# Altium project HYDRA_V2.1_POWER.PrjPcb
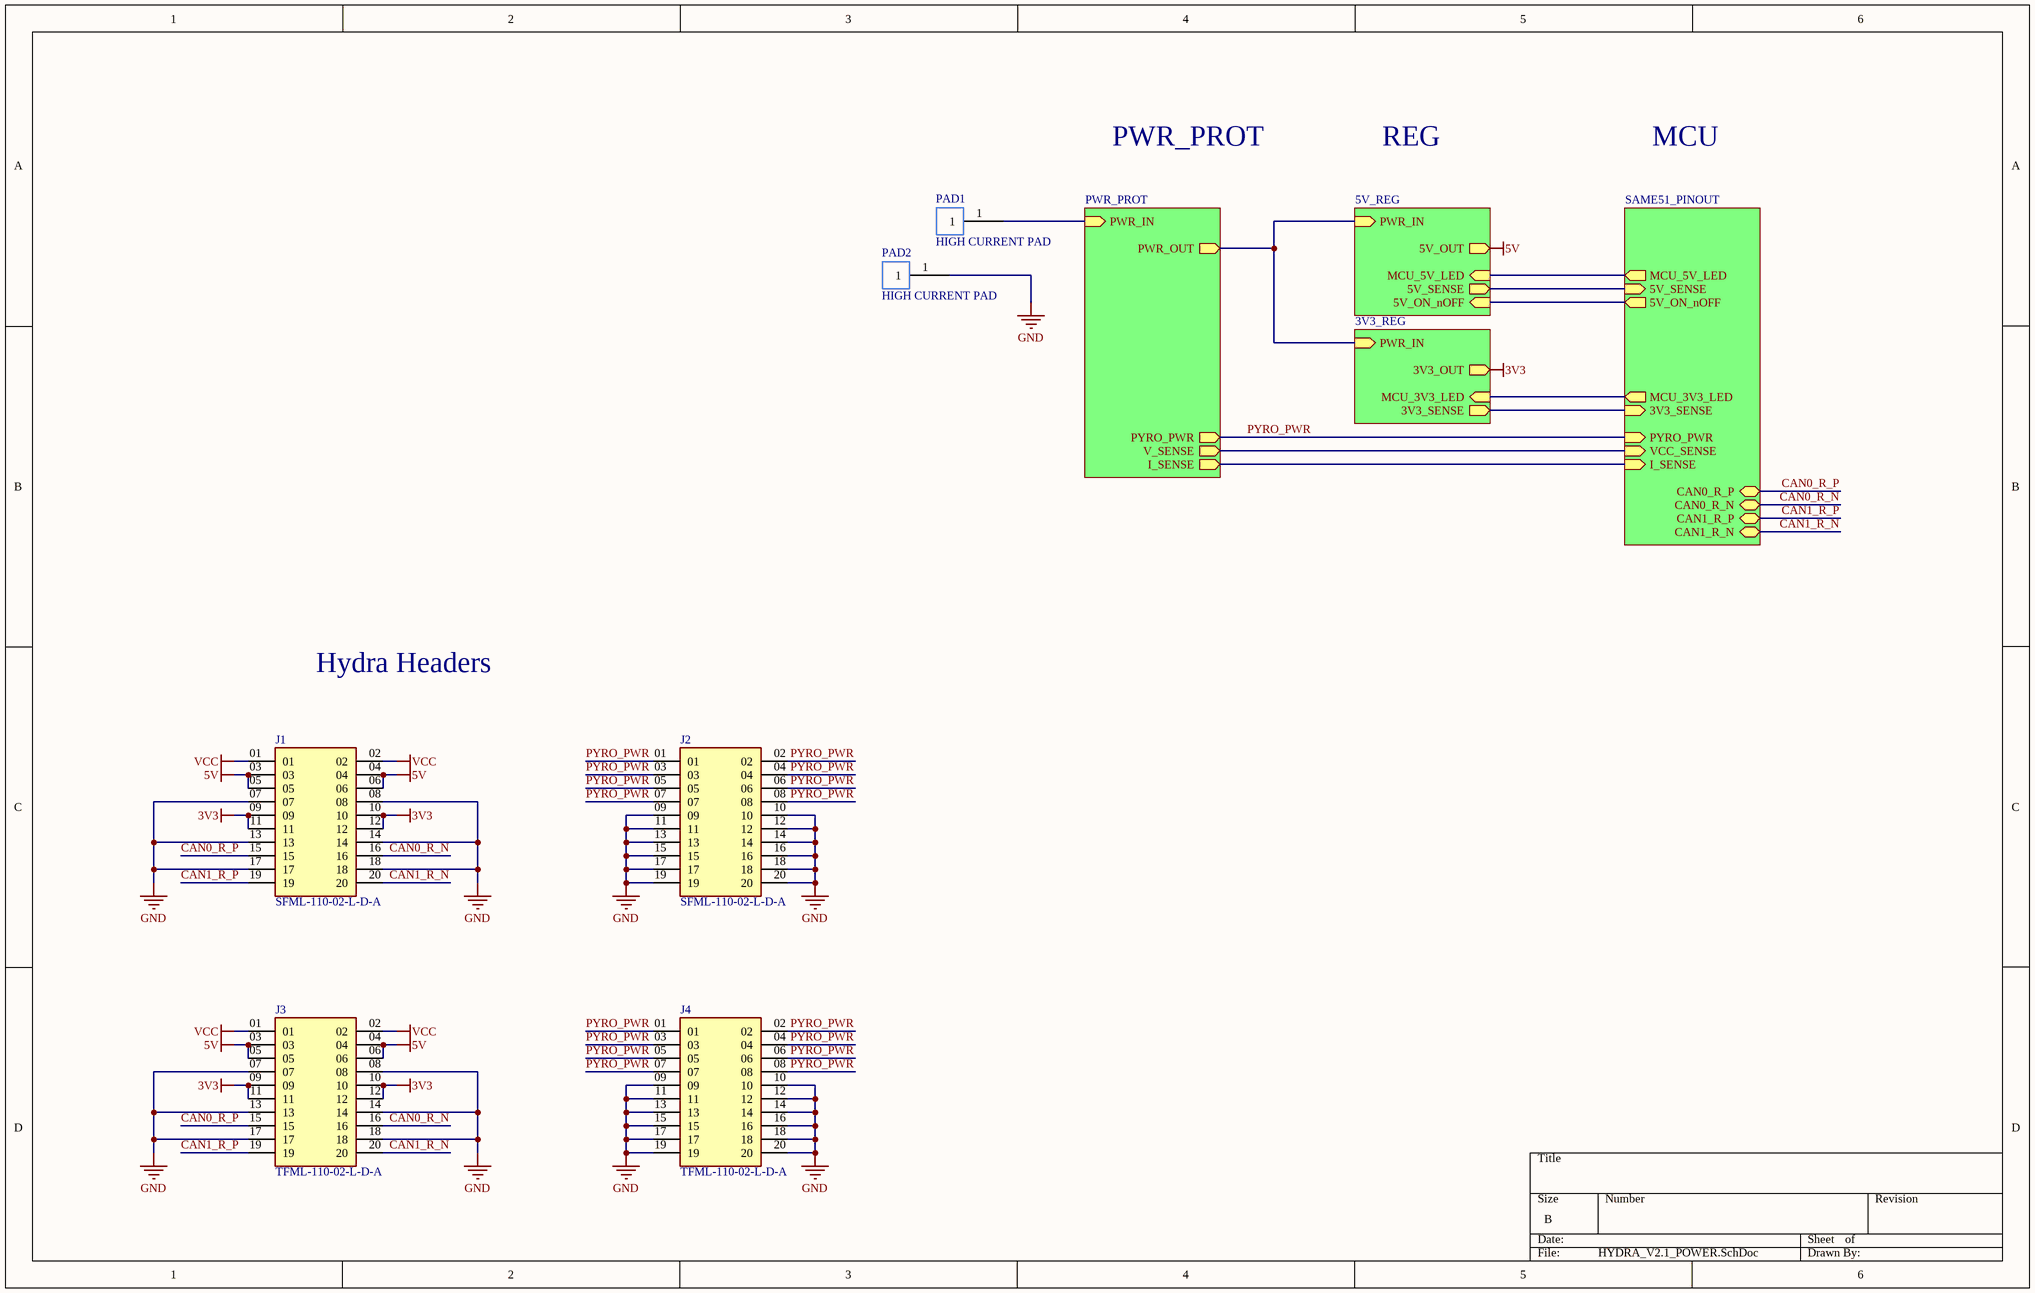
[diagram p0: HYDRA_V2.1_POWER.SchDoc]
5 sheets, 102 parts. Net scope: hierarchical (ports join the sheet entries above them; power ports are global).
Board file: HYDRA_V2.1_POWER.PcbDoc
Sheets:
  HYDRA_V2.1_POWER.SchDoc
    MCU_PINOUT = SAME51_PINOUT.SchDoc
    5V_REG = 5V_REG.SchDoc
    3V3_REG = 3V3_REG.SchDoc
    PWR_PROT = PWR_PROT.SchDoc

## Sheet HYDRA_V2.1_POWER.SchDoc
size B; SheetNumber: 1; SheetTotal: 6

### Parts
J1  SFML-110-02-L-D-A  [SFML-110-02-L-D-A-Footprint-1]
J2  SFML-110-02-L-D-A  [SFML-110-02-L-D-A-Footprint-1]
J3  TFML-110-02-L-D-A  [TFML-110-02-L-D-A-Footprint-1]
J4  TFML-110-02-L-D-A  [TFML-110-02-L-D-A-Footprint-1]
PAD1  HIGH CURRENT PAD  [HIGH CURRENT PAD-Footprint-1]
PAD2  HIGH CURRENT PAD  [HIGH CURRENT PAD-Footprint-1]

### Sub-sheets
3V3_REG = 3V3_REG: PWR_IN (in), 3V3_OUT (out), MCU_3V3_LED (in), 3V3_SENSE (out)
5V_REG = 5V_REG: PWR_IN (in), 5V_OUT (out), MCU_5V_LED (in), 5V_SENSE (out), 5V_ON_nOFF (in)
MCU_PINOUT = SAME51_PINOUT: CAN0_R_P (bidir), CAN0_R_N (bidir), PYRO_PWR (in), CAN1_R_P (bidir), CAN1_R_N (bidir), VCC_SENSE (in), I_SENSE (in), 5V_SENSE (in), MCU_5V_LED (out), 3V3_SENSE (in), MCU_3V3_LED (out), 5V_ON_nOFF (out)
PWR_PROT = PWR_PROT: PWR_IN (in), PWR_OUT (out), V_SENSE (out), I_SENSE (out), PYRO_PWR (out)

### Nets
3V3: J1.09 J1.10 J1.11 J1.12 J3.09 J3.10 J3.11 J3.12 ; sheet 3V3_REG/3V3_OUT  [project net 3V3_FB]
5V: J1.03 J1.04 J1.05 J1.06 J3.03 J3.04 J3.05 J3.06 ; sheet 5V_REG/5V_OUT  [project net 5V_FB]
GND: J1.07 J1.08 J1.13 J1.14 J1.17 J1.18 J2.09 J2.10 J2.11 J2.12 J2.13 J2.14 J2.15 J2.16 J2.17 J2.18 J2.19 J2.20 J3.07 J3.08 J3.13 J3.14 J3.17 J3.18 J4.09 J4.10 J4.11 J4.12 J4.13 J4.14 J4.15 J4.16 J4.17 J4.18 J4.19 J4.20 PAD2.1
VCC: J1.01 J1.02 J3.01 J3.02
3V3_SENSE: sheet MCU_PINOUT/3V3_SENSE, sheet 3V3_REG/3V3_SENSE
5V_ON_nOFF: sheet MCU_PINOUT/5V_ON_nOFF, sheet 5V_REG/5V_ON_nOFF
5V_SENSE: sheet MCU_PINOUT/5V_SENSE, sheet 5V_REG/5V_SENSE
CAN0_R_N: J1.16 J3.16 ; sheet MCU_PINOUT/CAN0_R_N
CAN0_R_P: J1.15 J3.15 ; sheet MCU_PINOUT/CAN0_R_P
CAN1_R_N: J1.20 J3.20 ; sheet MCU_PINOUT/CAN1_R_N
CAN1_R_P: J1.19 J3.19 ; sheet MCU_PINOUT/CAN1_R_P
I_SENSE: sheet MCU_PINOUT/I_SENSE, sheet PWR_PROT/I_SENSE
MCU_3V3_LED: sheet MCU_PINOUT/MCU_3V3_LED, sheet 3V3_REG/MCU_3V3_LED
MCU_5V_LED: sheet MCU_PINOUT/MCU_5V_LED, sheet 5V_REG/MCU_5V_LED
POST_SHUNT: sheet 5V_REG/PWR_IN, sheet 3V3_REG/PWR_IN, sheet PWR_PROT/PWR_OUT
PYRO_PWR: J2.01 J2.02 J2.03 J2.04 J2.05 J2.06 J2.07 J2.08 J4.01 J4.02 J4.03 J4.04 J4.05 J4.06 J4.07 J4.08 ; sheet MCU_PINOUT/PYRO_PWR, sheet PWR_PROT/PYRO_PWR
V_SENSE: sheet MCU_PINOUT/VCC_SENSE, sheet PWR_PROT/V_SENSE
NetF2_1: PAD1.1 ; sheet PWR_PROT/PWR_IN

### Notes on the sheet
- PWR_PROT
- REG
- MCU
- Hydra Headers

### Library data of the parts
J1 J2 = CMP-002-00076-2: Headers & Wire Housings .050 Tiger Eye High-Reliability Locking Socket Strip
J3 J4 = CMP-002-00077-1: Conn Shrouded Header (4 Sides) HDR 20 POS 1.27mm Solder ST Top Entry SMD TIGER EYE™ Tube
PAD1 PAD2 = CMP-002-00087-2: Via stitched high current pad

## Sheet SAME51_PINOUT.SchDoc
size B; SheetNumber: 2; SheetTotal: 6
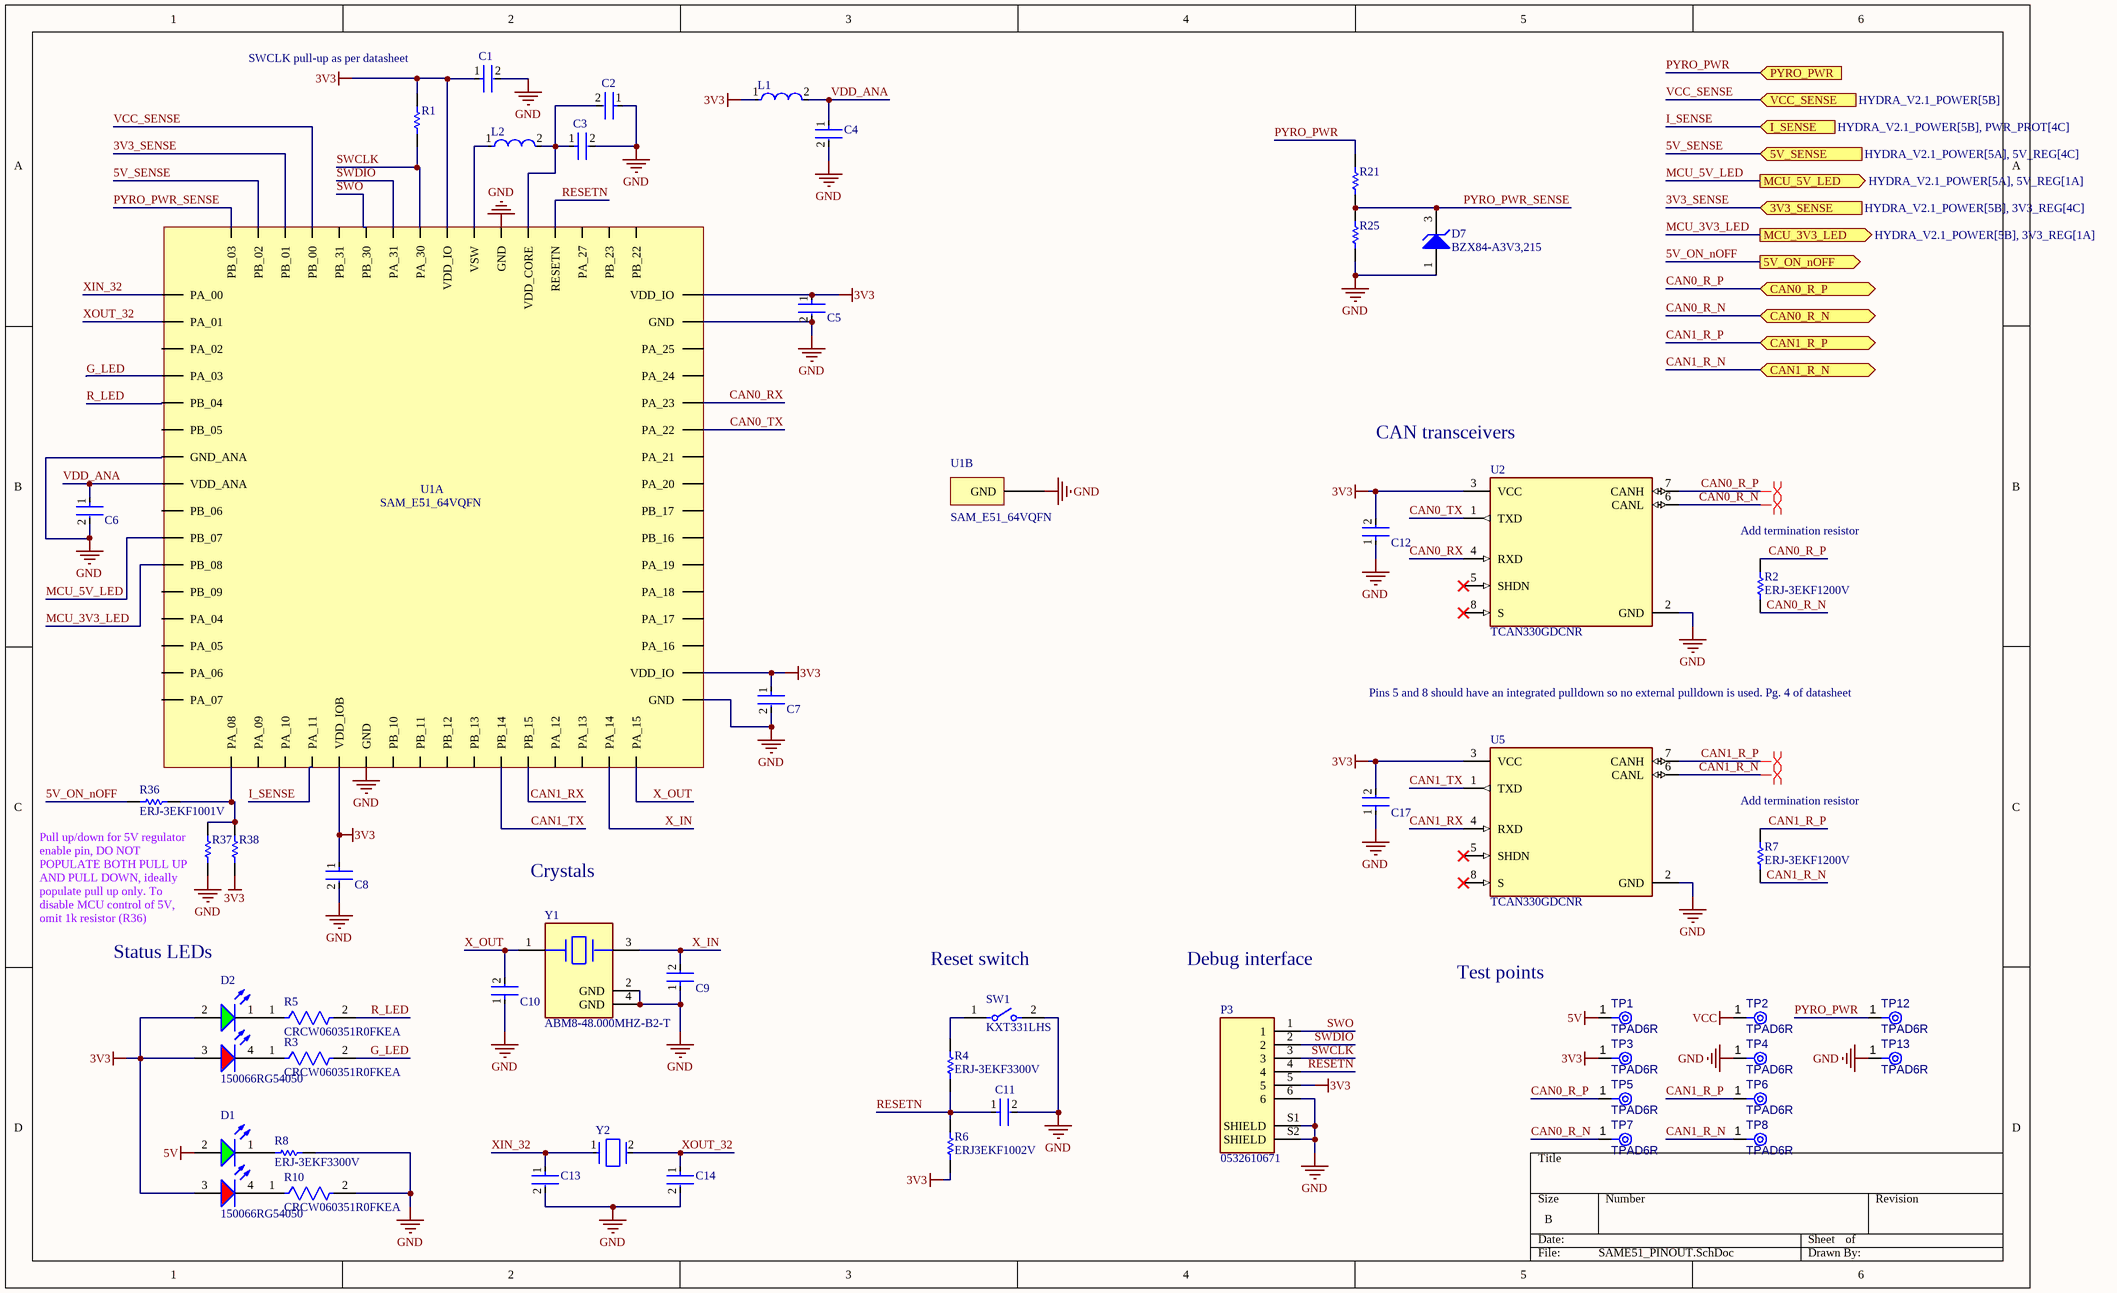
[diagram p1: SAME51_PINOUT.SchDoc]

### Parts
C1  C0402C104K8PACTU  [FP-C0402-BB-MFG]  (value not drawn)
C2  GRM155R60J475ME47D  [FP-GRM155-0_1-IPC_B]  (value not drawn)
C3  C0402C104K8PACTU  [FP-C0402-BB-MFG]  (value not drawn)
C4  C0805C106K8PACTU  [FP-C0805C-DG-MFG]  (value not drawn)
C5  C0402C104K8PACTU  [FP-C0402-BB-MFG]  (value not drawn)
C6  C0402C104K8PACTU  [FP-C0402-BB-MFG]  (value not drawn)
C7  C0402C104K8PACTU  [FP-C0402-BB-MFG]  (value not drawn)
C8  C0402C104K8PACTU  [FP-C0402-BB-MFG]  (value not drawn)
C9  08051A6R8CAT2A  [FP-0805-L_2_01_0_2-W_1_25-MFG]  (value not drawn)
C10  08051A6R8CAT2A  [FP-0805-L_2_01_0_2-W_1_25-MFG]  (value not drawn)
C11  C0402C104K8PACTU  [FP-C0402-BB-MFG]  (value not drawn)
C12  C0402C104K8PACTU  [FP-C0402-BB-MFG]  (value not drawn)
C13  C0805C180J5GACTU  [FP-C0805C-DN-MFG]  (value not drawn)
C14  C0805C180J5GACTU  [FP-C0805C-DN-MFG]  (value not drawn)
C17  C0402C104K8PACTU  [FP-C0402-BB-MFG]  (value not drawn)
D1  150066RG54050  [WL-SBCD_0606]
D2  150066RG54050  [WL-SBCD_0606]
D7  BZX84-A3V3,215  [SOT95P230X110-3N]
L1  NR6028T100M  [FP-NR6028-MFG]  (value not drawn)
L2  NR6028T100M  [FP-NR6028-MFG]  (value not drawn)
P3  0532610671  [0532610671-Footprint-1]
R1  ERJ3EKF1002V  [RESC1609X55X30LL15T15]  (value not drawn)
R2  ERJ-3EKF1200V  [RESC1609X55X30ML15T15]
R3  CRCW060351R0FKEA  [FP-CRCW0603-e3-MFG]
R4  ERJ-3EKF3300V  [RESC1608X55X30LL15T15]
R5  CRCW060351R0FKEA  [FP-CRCW0603-e3-MFG]
R6  ERJ3EKF1002V  [RESC1609X55X30LL15T15]
R7  ERJ-3EKF1200V  [RESC1609X55X30ML15T15]
R8  ERJ-3EKF3300V  [RESC1608X55X30LL15T15]
R10  CRCW060351R0FKEA  [FP-CRCW0603-e3-MFG]
R21  ERJ3EKF1002V  [RESC1609X55X30LL15T15]  (value not drawn)
R25  CRCW06032K70JNEA  [RESC1609X50X30ML10T20]  (value not drawn)
R36  ERJ-3EKF1001V  [RESC1608X55X30LL15T15]
R37  ERJ3EKF1002V  [RESC1609X55X30LL15T15]  (value not drawn)
R38  ERJ3EKF1002V  [RESC1609X55X30LL15T15]  (value not drawn)
SW1  KXT331LHS  [FP-KXT331LHS-MFG]
TP1  TPAD6R  [TP06R]  (no BOM)
TP2  TPAD6R  [TP06R]  (no BOM)
TP3  TPAD6R  [TP06R]  (no BOM)
TP4  TPAD6R  [TP06R]  (no BOM)
TP5  TPAD6R  [TP06R]  (no BOM)
TP6  TPAD6R  [TP06R]  (no BOM)
TP7  TPAD6R  [TP06R]  (no BOM)
TP8  TPAD6R  [TP06R]  (no BOM)
TP12  TPAD6R  [TP06R]  (no BOM)
TP13  TPAD6R  [TP06R]  (no BOM)
U1  SAM_E51_64VQFN  [SAM_E51_64VQFN-Footprint-1]  (parts A,B of 2)
U2  TCAN330GDCNR  [FP-DCN0008A-MFG]
U5  TCAN330GDCNR  [FP-DCN0008A-MFG]
Y1  ABM8-48.000MHZ-B2-T  [FP-ABM8-MFG]
Y2  ECS-.327-12.5-1210-TR  [FP-ECX-1210-MFG]  (value not drawn)

### Ports
3V3_SENSE (in, see HYDRA_V2.1_POWER[5B], 3V3_REG[4C]), 5V_ON_nOFF (out), 5V_SENSE (in, see HYDRA_V2.1_POWER[5A], 5V_REG[4C]), CAN0_R_N (bidir, see HYDRA_V2.1_POWER[6B]), CAN0_R_P (bidir, see HYDRA_V2.1_POWER[6B]), CAN1_R_N (bidir, see HYDRA_V2.1_POWER[6B]), CAN1_R_P (bidir, see HYDRA_V2.1_POWER[6B]), I_SENSE (in, see HYDRA_V2.1_POWER[5B], PWR_PROT[4C]), MCU_3V3_LED (out, see HYDRA_V2.1_POWER[5B], 3V3_REG[1A]), MCU_5V_LED (out, see HYDRA_V2.1_POWER[5A], 5V_REG[1A]), PYRO_PWR (in, see HYDRA_V2.1_POWER[5B], PWR_PROT[4B]), VCC_SENSE (in, see HYDRA_V2.1_POWER[5B])

### Nets
3V3: C1.1 C5.1 C7.1 C8.1 C12.2 C17.2 D1.3(A) D2.2(A) D2.3(A) L1.1 P3.5 R1.2 R6.1 R38.1 TP3.1(TP) U1.21(VDD_IOB) U1.34(VDD_IO) U1.48(VDD_IO) U1.56(VDD_IO) U2.3(VCC) U5.3(VCC)  [project net 3V3_FB]
5V: D1.2(A) TP1.1(TP)  [project net 5V_FB]
GND: C1.2 C2.1 C3.2 C4.2 C5.2 C6.2 C7.2 C8.2 C9.1 C10.1 C11.2 C12.1 C13.2 C14.2 C17.1 D7.1(A) P3.6 P3.S1(SHIELD) P3.S2(SHIELD) R8.2 R10.2 R25.1 R37.1 SW1.2 TP4.1(TP) TP13.1(TP) U1.7(GND_ANA) U1.22(GND) U1.33(GND) U1.47(GND) U1.54(GND) U1.65(GND) U2.2(GND) U5.2(GND) Y1.2(GND) Y1.4(GND)
VCC: TP2.1(TP)
3V3_SENSE: U1.62(PB_01) ; port 3V3_SENSE
5V_ON_nOFF: R36.1 ; port 5V_ON_nOFF
5V_SENSE: U1.63(PB_02) ; port 5V_SENSE
CAN0_R_N: R2.1 TP7.1(TP) U2.6(CANL) ; port CAN0_R_N
CAN0_R_P: R2.2 TP5.1(TP) U2.7(CANH) ; port CAN0_R_P
CAN0_RX: U1.44(PA_23) U2.4(RXD)
CAN0_TX: U1.43(PA_22) U2.1(TXD)
CAN1_R_N: R7.1 TP8.1(TP) U5.6(CANL) ; port CAN1_R_N
CAN1_R_P: R7.2 TP6.1(TP) U5.7(CANH) ; port CAN1_R_P
CAN1_RX: U1.28(PB_15) U5.4(RXD)
CAN1_TX: U1.27(PB_14) U5.1(TXD)
G_LED: R3.2 U1.4(PA_03)
I_SENSE: U1.20(PA_11) ; port I_SENSE
MCU_3V3_LED: U1.11(PB_08) ; port MCU_3V3_LED
MCU_5V_LED: U1.10(PB_07) ; port MCU_5V_LED
PYRO_PWR: R21.2 TP12.1(TP) ; port PYRO_PWR
PYRO_PWR_SENSE: D7.3(K) R21.1 R25.2 U1.64(PB_03)
R_LED: R5.2 U1.5(PB_04)
RESETN: C11.1 P3.4 R4.1 R6.2 U1.52(RESETN)
SWCLK: P3.3 R1.1 U1.57(PA_30)
SWDIO: P3.2 U1.58(PA_31)
SWO: P3.1 U1.59(PB_30)
VCC_SENSE: U1.61(PB_00) ; port VCC_SENSE  [project net V_SENSE]
VDD_ANA: C4.1 C6.1 L1.2 U1.8(VDD_ANA)
X_IN: C9.2 U1.31(PA_14) Y1.3
X_OUT: C10.2 U1.32(PA_15) Y1.1
XIN_32: C13.1 U1.1(PA_00) Y2.1(In/Out)
XOUT_32: C14.1 U1.2(PA_01) Y2.2(Out/In)
NetC2_2: C2.2 C3.1 L2.2 U1.53(VDD_CORE)
NetD1_1: D1.1(K) R8.1
NetD1_4: D1.4(K) R10.1
NetD2_1: D2.1(K) R5.1
NetD2_4: D2.4(K) R3.1
NetL2_1: L2.1 U1.55(VSW)
NetR4_2: R4.2 SW1.1
NetR36_2: R36.2 R37.2 R38.2 U1.17(PA_08)

Not connected (* = marked no-connect by the designer): U1 3(PA_02) 6(PB_05) 9(PB_06) 12(PB_09) 13(PA_04) 14(PA_05) 15(PA_06) 16(PA_07) 18(PA_09) 19(PA_10) 23(PB_10) 24(PB_11) 25(PB_12) 26(PB_13) 29(PA_12) 30(PA_13) 35(PA_16) 36(PA_17) 37(PA_18) 38(PA_19) 39(PB_16) 40(PB_17) 41(PA_20) 42(PA_21) 45(PA_24) 46(PA_25) 49(PB_22) 50(PB_23) 51(PA_27) 60(PB_31); U2 5(SHDN)* 8(S)*; U5 5(SHDN)* 8(S)*

### Layout directives
differential pair: CAN0_R_N, CAN0_R_P, CAN1_R_N, CAN1_R_P

### Notes on the sheet
- SWCLK pull-up as per datasheet
- (near U2) CAN transceivers
- (near R2) Add termination resistor
- Pins 5 and 8 should have an integrated pulldown so no external pulldown is used. Pg. 4 of datasheet
- (near R7) Add termination resistor
- Crystals
- Pull up/down for 5V regulator enable pin, DO NOT POPULATE BOTH PULL UP AND PULL DOWN, ideally populate pull up only. To disable MCU control of 5V, omit 1k resistor (R36)
- Status LEDs
- (near SW1) Reset switch
- Debug interface
- Test points

### Library data of the parts
C1 C3 C5-C8 C11 C12 C17 = CMP-2008-02046-2: CAP CER 0.1UF 10V X5R 0402; Manufacturer: Kemet; Material: Ceramic; Capacitance: 0.10 μF; Temperature Coefficient: 15%; Tolerance: 0.1; Value: 0.10 μF; Package: C0402-BB; Temperature: -55°C to +125°C; ComponentLink2Description: Datasheet; Temperature Characteristic: X5R; Device Class L1: Passive Components; Height: 0.55mm; Lead Free: Yes; ComponentLink2URL: https://content.kemet.com/datasheets/KEM_C1002_X7R_SMD.pdf; Device Class L2: Capacitors; Temperature Range Low: -55°C; Temperature Range High: +125°C; RoHS: TRUE; Octopart: https://octopart.com/c0402c104k8pactu-kemet-140039; Automotive: No; Mouser Description: Capacitor 100 nF 10 VDC 0402; Category: Cap; Voltage Rating: 10 V; Digikey Description: CAP CER 0.1UF 10V X5R 0402; Ipc Land Pattern Name: CAPC10050X50; Device Class L3: Ceramic Capacitors; Manufacturer Part Number: C0402C104K8PACTU
C2 = CMP-2008-04549-2: Chip Multilayer Ceramic Capacitors for General Purpose, 0402, 4.7uF, X5R, 15%, 20%, 6.3V; Height: 0.5mm; Weight: 0.000212oz; Length: 1mm; Case Code (Metric): 1005; Packaging: Tape and Reel; Termination: SMD/SMT; Dielectric: X5R; Depth: 0.5mm; Case Code (Imperial): 0402; Min Operating Temperature: -55°C; Case/Package: 0402; Voltage: 6.3V; Width: 0.02inch; Capacitance: 4.7uF; Lead Free: Lead Free; Thickness: 0.022inch; Contact Plating: Tin; REACH SVHC: No SVHC; Package Quantity: 10000; Tolerance: 20%; Voltage Rating (DC): 6.3V; Voltage Rating: 6.3V; Mount: Surface Mount; Max Operating Temperature: 85°C
C4 = CMP-2007-03243-2: CAP CER 10UF 10V X5R 0805; Manufacturer: Kemet; 3DS Part Number: 220-00001; Tolerance: 10%; Temperature Coefficient: 15%; Material: Ceramic; Device Class L2: Capacitors; Device Class L1: Passive Components; ComponentLink2URL: https://content.kemet.com/datasheets/KEM_C1006_X5R_SMD.pdf; Height: 1.4mm; Lead Free: Yes; Manufacturer Part Number: C0805C106K8PACTU; Digikey Description: CAP CER 10UF 10V X5R 0805; Octopart: https://octopart.com/c0805c106k8pactu-kemet-98697; Capacitance: 10uF; Value: 10uF; Temperature Range Low: -55°C; Temperature: -55°C to +85°C; Automotive: No; Mouser Description: CAP CER 10UF 10V X5R 0805; Ipc Land Pattern Name: CAPC200125X125; Temperature Range High: +85°C; Voltage: 10V; RoHS: TRUE; Device Class L3: Ceramic Capacitors; ComponentLink2Description: Datasheet; Voltage Rating: 10V; Package: C0805C-DG; Temperature Characteristic: X5R; Category: Cap
C9 C10 = CMP-1036-00709-3: General Purpose Ceramic Capacitor, 0805, 6.8pF, 0.25pF, C0G, 30ppm/°C, 100V; Dissipation Factor: 10%; Insulation Resistance: 100GR; Tolerance: 5%; Max Operating Temperature: 125°C; RoHS Compliant: Yes; Capacitance: 6.8pF; Termination: SMD/SMT; Number of Pins: 2; Packaging: Tape and Reel; Mount: Surface Mount; Case Code (Metric): 2012; Case Code (Imperial): 0805; Height: 0.71mm; Min Operating Temperature: -55°C; Width: 0.049inch; Temperature Coefficient: 0ppm/°C; Length: 2.01mm; Dielectric: C0G; Series: -; Voltage Rating (DC): 100V; Dielectric Material: Ceramic; Depth: 1.25mm; Contact Plating: Tin; Voltage Rating: 100V; Thickness: 0.037inch; Case/Package: 0805; Lead Free: Lead Free; Radiation Hardening: No; Voltage: 100V; Construction: Flat; Package Quantity: 1; REACH SVHC: No SVHC
C13 C14 = CMP-2007-00302-2: CAP CER 18PF 50V C0G/NP0 0805; Manufacturer: KEMET; Temperature Characteristic: C0G; Tolerance: 0.05; Material: Ceramic; Temperature Coefficient: 30ppm/°C; Device Class L2: Capacitors; Capacitance: 18 pF; Temperature: -55°C to +125°C; Value: 18 pF; Package: C0805C-DN; Mouser Description: Cap Ceramic 18pF 50V C0G 5% SMD 0805 125C Paper T/R; Height: 0.88mm; ComponentLink2URL: https://content.kemet.com/datasheets/KEM_C1003_C0G_SMD.pdf; RoHS: TRUE; Octopart: https://octopart.com/c0805c180j5gactu-kemet-144810; ComponentLink2Description: Datasheet; Temperature Range High: +125°C; Digikey Description: CAP CER 18PF 50V C0G/NP0 0805; Device Class L1: Passive Components; Category: Cap; Automotive: No; Device Class L3: Ceramic Capacitors; Voltage Rating: 50 V; Temperature Range Low: -55°C; Ipc Land Pattern Name: CAPC200125X78; Lead Free: Yes; Manufacturer Part Number: C0805C180J5GACTU
D1 D2 = CMP-004-00034-2: Led, Red/Grn, 180Mcd/230Mcd, 624Nm/525Nm Rohs Compliant: Yes
D7 = CMP-004-00035-1: DIODE ZENER 3.3V 250MW SOT23
L1 L2 = CMP-14484-000406-1: SMD Power Inductors 10uH ±20% 1.9A 84.5mΩ; Core Material: Ferrite; Self Resonant Frequency: 20MHz; Test Frequency: 100kHz; DC Resistance (DCR): 84.5mR; Shielding: Shielded; Current Rating: 1.9A; Package Quantity: 2000; Tolerance: 20%; Saturation Current: 1.9A; Max Operating Temperature: 120°C; Case/Package: 2424; Number of Pins: 2; Lead Free: Lead Free; Series: NR; Inductance Tolerance: 20%; RMS Current (Irms): 1.9A; Max DC Current: 1.9A; Resistor Type: Wirewound; Min Operating Temperature: -25°C; Width: 6mm; Height - Seated (Max): 0.11inch; RoHS Compliant: Yes; Mount: Surface Mount; Packaging: Tape and Reel; Inductance: 10uH; Length: 0.236inch; Halogen Free: Halogen Free; Height: 2.8mm; Termination: SMD/SMT
P3 = CMP-002-00079-1: Conn Shrouded Header (4 Sides) HDR 6 POS 1.25mm Solder RA Side Entry SMD PicoBlade™ T/R
R1 R6 R21 R37 R38 = CMP-1012-00623-3: Chip Resistor, 10 KOhm, +/- 1%, 0.1 W, -55 to 155 degC, 0603 (1608 Metric), RoHS, Tape and Reel; Manufacturer: Panasonic; Voltage Rating: 75V; Case\/Package: 0603; Power Rating: 100mW; Resistance: 10KOhm; Temperature Coefficient: 100ppm\/degreesC; Number of Pins: 2; Package Reference: 603; Depth: 0.8mm; Mount: SurfaceMount; Package Description: 2-Pin Surface Mount Device, Body 1.6 x 0.85 mm; Datasheet Version: 02/2017; Length: 1.6mm; Lead Free: LeadFree; Height: 0.45mm; Number of Terminations: 2; Max Power Dissipation: 100mW; Min Operating Temperature: -55degC; Datasheet URL: https://industrial.panasonic.com/cdbs/www-data/pdf/RDA0000/AOA0000C304.pdf; Termination: SMD/SMT; Case Code (Metric): 1608; Case Code (Imperial): 0603; Tolerance: 1%; Max Operating Temperature: 155degC; RoHSCompliant: true; Voltage Rating (DC): 75V; Radiation Hardening: No; Packaging: TapeandReel; Composition: ThickFilm; Mounting Technology: SurfaceMount; Manufacturer URL: http://www.panasonic.com/; Width: 0.031inch; REACH SVHC: NoSVHC; Contact Plating: Tin; Military Standard: Not; Package Quantity: 1
R2 R7 = CMP-2000-00213-2: Chip Resistor, 120 Ohm, +/- 1%, 0.1 W, -55 to 155 degC, 0603 (1608 Metric), RoHS, Tape and Reel; Manufacturer: Panasonic; Power Rating: 100mW; Voltage Rating (DC): 75V; Resistance: 120Ohm; Temperature Coefficient: 100ppm/degreesC; Number of Terminations: 2; Military Standard: Not; Tolerance: 1%; Min Operating Temperature: -55degC; Packaging: TapeandReel; Lead Free: LeadFree; Max Operating Temperature: 155degC; Manufacturer URL: http://www.panasonic.com/; Case Code (Imperial): 0603; REACH SVHC: NoSVHC; Width: 0.031inch; Datasheet URL: https://industrial.panasonic.com/cdbs/www-data/pdf/RDA0000/AOA0000C283.pdf; RoHSCompliant: true; Max Power Dissipation: 100mW; Termination: SMD/SMT; Package Reference: 0603; Height: 0.022inch; Depth: 0.8mm; Package Description: 2-Pin Surface Mount Device, Body 1.6 x 0.85 mm; Contact Plating: Tin; Length: 1.6mm; Package URL: http://www.st.com/st-web-ui/static/active/en/resource/technical/document/datasheet/CD00001320.pdf; Radiation Hardening: No; Package Quantity: 1; Number of Pins: 2; Datasheet Version: 42095.0; Voltage Rating: 75V; Composition: ThickFilm; Case/Package: 0603; Mount: SurfaceMount; Case Code (Metric): 1608
R3 R5 R10 = CMP-2000-03446-2: RES Thick Film, 51Ω, 1%, 0.1W, 100ppm/°C, 0603; Power Rating: 100mW; Voltage Rating: 75V; Resistance: 51R; Military Standard: Not; Case Code (Imperial): 0603; Max Operating Temperature: 155°C; Temperature Coefficient: 100ppm/°C; Lead Free: Lead Free; Weight: 7.1E-05oz; Number of Pins: 2; Package Quantity: 10; Case/Package: 0603; Termination: SMD/SMT; Min Operating Temperature: -55°C; Tolerance: 1%; Contact Plating: Tin; Height: 0.45mm; Working Voltage: 75V; Radiation Hardening: No; Packaging: Tape and Reel; Composition: Thick Film; Max Power Dissipation: 100mW; Width: 0.85mm; Depth: 0.85mm; Length: 1.55mm; Case Code (Metric): 1608; Voltage Rating (DC): 75V; Number of Terminations: 2; Features: Automotive AEC-Q200
R4 R8 = CMP-2000-00435-2: Chip Resistor, 330 Ohm, +/- 1%, 0.1 W, -55 to 155 degC, 0603 (1608 Metric), RoHS, Tape and Reel; Gender: Male; Mating Cycles: 10000; Current Rating: 500 mA; Voltage Rating: 10 V; REACH SVHC: No SVHC; PackageDescription: 2-Pin Surface Mount Device, Body 1.6 x 0.85 mm; Contact Finish: Gold; Pins: 8; ComponentLink1Description: Manufacturer URL; Packaging: Tape and Reel; Max Operating Temperature: 85 degC; Contact Material: Copper; Height: 1.45 mm; Width: 1.45 mm; DatasheetVersion: Apr-15; Package Quantity: 1500; Contact Plating: Gold; PackageReference: 0603; Mount: Surface Mount; Lead Pitch: 1.1 mm; Min Operating Temperature: -25 degC; ComponentLink1URL: http://www.panasonic.com/; ComponentLink2URL: http://industrial.panasonic.com/cdbs/www-data/pdf/RDA0000/AOA0000C86.pdf; Length: 13.7 mm; ComponentLink2Description: Datasheet; RoHSCompliant: true
R25 = CMP-2000-03183-1: Manufacturer: Vishay Dale; Part Number: CRCW06032K70JNEA
R36 = CMP-2000-00180-1: Manufacturer: Panasonic; Part Number: ERJ-3EKF1001V
SW1 = CMP-10040-000029-1: SWITCH TACTILE SPST-NO 0.02A 15V; Operating Force: 240gf; Switch Travel: 0.13mm; Illumination Type: Non-Illuminated; Throw Configuration: SPST; Number of Ports: 1; Current Rating: 5A; Mechanical Life: 500000Cycles; Switch Function: Off-Mom; Connector Type: USB; Actuator Type: Standard; Gender: Receptacle; Number of Contacts: 24; Contact Plating: Gold; Insulation Color: Black; Min Operating Temperature: -40°C; Packaging: Tape and Reel; Flammability Rating: UL94 V-0; Max Operating Temperature: 85°C; Termination: Solder; Mount: Surface Mount
TP1-TP8 TP12 TP13 = CMP-00028-00002-2: 0.6mm round; Pins: 1
U1 = CMP-016-00010-6: Rudimentary symbol and footprint for the SAM E51 microcontroller
U2 U5 = CMP-04872-000178-1: IC TRANSCEIVER 1/1 SOT23-8; Data Rate: 1Mbps; Packaging: Tape and Reel; Min Operating Temperature: -40°C; Max Operating Temperature: 125°C; RoHS Compliant: Yes; Lead Free: Lead Free; Case/Package: SOT-23-8; Mount: Surface Mount
Y1 = CMP-27762-011708-1: Crystal 48MHz ±20ppm 18pF SMD-4 3.2mm x 2.5mm; Series Resistance: 35R; Frequency Stability: 50ppm; Package Quantity: 1000; Packaging: Tape and Reel; Mount: Surface Mount; Length: 3.2mm; Load Capacitance: 18pF; Max Operating Temperature: 70°C; Operating Frequency: 48 MHz; RoHS Compliant: Yes; Series: ABM8; Frequency Tolerance: 20ppm; Lead Free: Lead Free; Min Operating Temperature: -20°C; Case/Package: CSMD; Number of Pins: 4; Height: 0.031inch; ESR (Equivalent Series Resistance): 35R; Frequency: 48MHz; Radiation Hardening: No; Width: 0.098inch; Tolerance: 20ppm; Termination: SMD/SMT; Depth: 2.5mm; Resistor Type: Ceramic; REACH SVHC: No SVHC
Y2 = CMP-40224-000006-1: CRYSTAL 32.7680KHZ 12.5PF SMD; Manufacturer: ECS International; Frequency: 32.768kHz; Esr: 90kΩ; Tolerance: 20ppm; Device Class L1: Passive Components; Load Capacitance: 12.5pF; Temperature: -40°C to +85°C; ComponentLink2URL: https://ecsxtal.com/store/pdf/ECX-1210.pdf; Series: ECX-1210; Octopart: https://octopart.com/ecs-.327-12.5-1210-tr-ecs+international-81221340; ComponentLink2Description: Datasheet; Temperature Range Low: -40°C; Digikey Description: CRYSTAL 32.7680KHZ 12.5PF SMD; Lead Free: Yes; RoHS: TRUE; Device Class L3: Crystals; Automotive: No; Category: Crys; Height: 0.5mm; Manufacturer Part Number: ECS-.327-12.5-1210-TR; Temperature Range High: +85°C; Device Class L2: Crystals / Oscillators; Package: ECX-1210

## Sheet 5V_REG.SchDoc
size A4; SheetNumber: 3; SheetTotal: 6
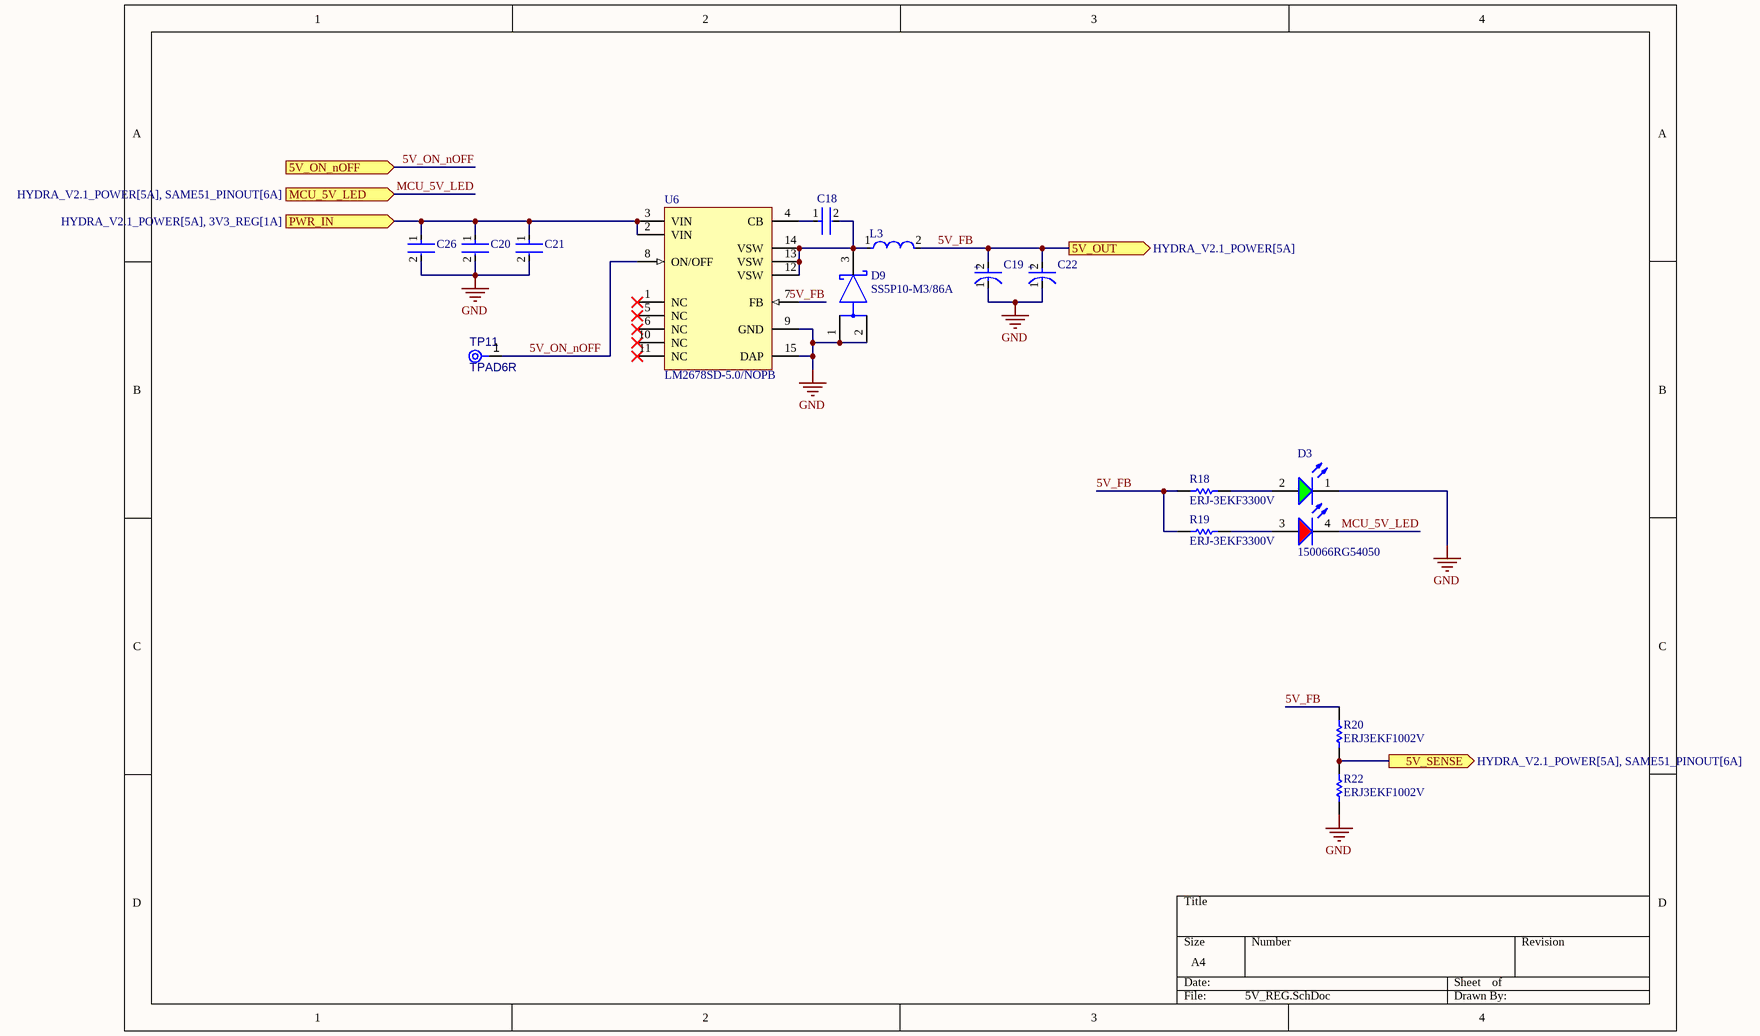
[diagram p2: 5V_REG.SchDoc]

### Parts
C18  C0805C103J5RACTU  [FP-C0805C-DN-MFG]  (value not drawn)
C19  10TPC68M  [FP-POSCAP-D2-MFG]  (value not drawn)
C20  C2012X5R1V156M125AC  [FP-C2012-125-0_2-MFG]  (value not drawn)
C21  C2012X5R1V156M125AC  [FP-C2012-125-0_2-MFG]  (value not drawn)
C22  10TPC68M  [FP-POSCAP-D2-MFG]  (value not drawn)
C26  C2012X5R1V156M125AC  [FP-C2012-125-0_2-MFG]  (value not drawn)
D3  150066RG54050  [WL-SBCD_0606]
D9  SS5P10-M3/86A  [FP-95570-MFG]
L3  IHLP4040DZER220M11  [FP-IHLP-4040DZ-FP_3_124x3-MFG]  (value not drawn)
R18  ERJ-3EKF3300V  [RESC1608X55X30LL15T15]
R19  ERJ-3EKF3300V  [RESC1608X55X30LL15T15]
R20  ERJ3EKF1002V  [RESC1609X55X30LL15T15]
R22  ERJ3EKF1002V  [RESC1609X55X30LL15T15]
TP11  TPAD6R  [TP06R]  (no BOM)
U6  LM2678SD-5.0/NOPB  [NHM0014A_V]

### Ports
5V_ON_nOFF (in), 5V_OUT (out, see HYDRA_V2.1_POWER[5A]), 5V_SENSE (out, see HYDRA_V2.1_POWER[5A], SAME51_PINOUT[6A]), MCU_5V_LED (in, see HYDRA_V2.1_POWER[5A], SAME51_PINOUT[6A]), PWR_IN (in, see HYDRA_V2.1_POWER[5A], 3V3_REG[1A])

### Nets
5V_FB: C19.2(A) C22.2(A) L3.2 R18.1 R19.1 R20.2 U6.7(FB) ; port 5V_OUT
GND: C19.1(C) C20.2 C21.2 C22.1(C) C26.2 D3.1(K) D9.1(A) D9.2(A) R22.1 U6.9(GND) U6.15(DAP)
5V_ON_nOFF: TP11.1(TP) U6.8(ON/OFF) ; port 5V_ON_nOFF
5V_SENSE: R20.1 R22.2 ; port 5V_SENSE
MCU_5V_LED: D3.4(K) ; port MCU_5V_LED
POST_SHUNT: C20.1 C21.1 C26.1 U6.2(VIN) U6.3(VIN) ; port PWR_IN
NetC18_1: C18.1 U6.4(CB)
NetC18_2: C18.2 D9.3(C) L3.1 U6.12(VSW) U6.13(VSW) U6.14(VSW)
NetD3_2: D3.2(A) R18.2
NetD3_3: D3.3(A) R19.2

Not connected (* = marked no-connect by the designer): U6 1(NC)* 5(NC)* 6(NC)* 10(NC)* 11(NC)*

### Notes on the sheet
- (in symbol CMP-05428-000598-1) +

### Library data of the parts
C18 = CMP-2007-00254-2: CAP CER 10000PF 50V X7R 0805; Manufacturer: KEMET; Value: 10,000 pF; Material: Ceramic; Temperature Coefficient: 30ppm/°C; Tolerance: 0.05; Device Class L1: Passive Components; Temperature: -55°C to +125°C; Lead Free: Yes; ComponentLink2URL: https://content.kemet.com/datasheets/KEM_C1003_C0G_SMD.pdf; Device Class L3: Ceramic Capacitors; Temperature Characteristic: X7R; Temperature Range High: +125°C; Mouser Description: Capacitor; Ceramic; Cap 0.01uF; Tol 5%; Vol-Rtg 50 V; SMT; Case 0805; X7R; TR; ComponentLink2Description: Datasheet; Manufacturer Part Number: C0805C103J5RACTU; Height: 0.88mm; Digikey Description: CAP CER 10000PF 50V X7R 0805; Capacitance: 10,000 pF; Temperature Range Low: -55°C; Device Class L2: Capacitors; Octopart: https://octopart.com/c0805c103j5ractu-kemet-133473; Voltage Rating: 50 V; Category: Cap; RoHS: TRUE; Automotive: No; Package: C0805C-DN; Ipc Land Pattern Name: CAPC200125X78
C19 C22 = CMP-05428-000598-1: Molded Tantalum Polymer Capacitor 68uF 20% 10V life 2000Hours SMD 2917; Dissipation Factor: 10%; ESR (Equivalent Series Resistance): 45mR; Leakage Current: 68uA; Polarity: Polar; Ripple Current: 1.7A; Material: Polymer; Voltage Rating: 10V; Voltage: 10V; Features: General Purpose; Width: 4.3mm; Packaging: Tape and Reel; Termination: SMD/SMT; Radiation Hardening: No; Construction: Flat; Height: 1.9mm; Height - Seated (Max): 0.079inch; Case Code (Metric): 7343; Length: 7.3mm; Case/Package: 2917; Depth: 4.3mm; Mount: Surface Mount; Capacitance: 68uF; Case Code (Imperial): 2917; Package Quantity: 3000; Tolerance: 20%; REACH SVHC: No SVHC; Series: POSCAP™ TPC; Lead Free: Lead Free; Min Operating Temperature: -55°C; RoHS Compliant: Yes; Voltage Rating (DC): 10V; Number of Pins: 2; Max Operating Temperature: 105°C
C20 C21 C26 = CMP-08246-005496-1: Multilayer Ceramic Capacitors 15μF ±20% 35V X5R SMD 0805; Capacitance: 15uF; Mount: Surface Mount; Dielectric Material: Ceramic; Package Quantity: 2000; Termination: SMD/SMT; Height: 1.25mm; Min Operating Temperature: -55°C; Tolerance: 20%; Width: 0.049inch; Length: 0.079inch; Lead Free: Lead Free; Max Operating Temperature: 85°C; Voltage Rating: 35V; Case/Package: 0805; Packaging: Tape and Reel; RoHS Compliant: Yes; Case Code (Metric): 2012; Voltage Rating (DC): 35V; Dielectric: X5R; Thickness: 0.057inch; Case Code (Imperial): 0805; Resistor Type: Ceramic; Series: C
D3 = CMP-004-00034-2: as D1 on sheet SAME51_PINOUT
D9 = CMP-02539-000057-1: DIODE SCHOTTKY 100V 5A TO277A; Max Forward Surge Current (Ifsm): 150A; Element Configuration: Common Cathode; Max Reverse Leakage Current: 15uA; Forward Voltage: 880mV; Case/Package: TO-277A; Number of Pins: 3; Max Reverse Voltage (DC): 100V; Height: 0.031inch; Peak Non-Repetitive Surge Current: 150A; Series: eSMP®; Radiation Hardening: No; Length: 0.242inch; Max Repetitive Reverse Voltage (Vrrm): 100V; Forward Current: 5A; Width: 0.171inch; Min Operating Temperature: -55°C; Max Surge Current: 150A; Lead Free: Lead Free; RoHS Compliant: Yes; Average Rectified Current: 5A; Max Operating Temperature: 150°C; Max Reverse Current: 15uA; Package Quantity: 1500; Packaging: Tape and Reel; Mount: Surface Mount
L3 = CMP-02424-000785-1: Commercial Inductors, Low DCR Series 22uH 5A 66mΩ 20%; Shielding: Shielded; Max DC Current: 4.5A; Test Frequency: 100kHz; DC Resistance (DCR): 66mR; Self Resonant Frequency: 1MHz; Core Material: Metal; Series: IHLP-4040DZ-11; Min Operating Temperature: -55°C; Rated Current-Max: 5A; Current Rating: 5A; Military Standard: Not; Depth: 10.3mm; Height - Seated (Max): 0.157inch; Contact Plating: Tin; Termination: SMD/SMT; Length: 0.43inch; Package Quantity: 1; Width: 0.405inch; Inductance Tolerance: 20%; Tolerance: 20%; Height: 4mm; RMS Current (Irms): 5A; Saturation Current: 4.5A; Inductance: 22uH; Mount: Surface Mount; Max Operating Temperature: 125°C; Case/Package: 4040; Packaging: Tape and Reel; Radiation Hardening: No; RoHS Compliant: Yes; Lead Free: Lead Free
R18 R19 = CMP-2000-00435-2: as R4 on sheet SAME51_PINOUT; REACH SVHC: No SVHC; PackageDescription: 2-Pin Surface Mount Device, Body 1.6 x 0.85 mm; Contact Finish: Gold; Pins: 8; ComponentLink1Description: Manufacturer URL; Packaging: Tape and Reel; Max Operating Temperature: 85 degC; Contact Material: Copper; Height: 1.45 mm; Width: 1.45 mm; DatasheetVersion: Apr-15; Package Quantity: 1500; Contact Plating: Gold; PackageReference: 0603; Mount: Surface Mount; Lead Pitch: 1.1 mm; Min Operating Temperature: -25 degC; ComponentLink1URL: http://www.panasonic.com/; ComponentLink2URL: http://industrial.panasonic.com/cdbs/www-data/pdf/RDA0000/AOA0000C86.pdf; Length: 13.7 mm; ComponentLink2Description: Datasheet; RoHSCompliant: true
R20 R22 = CMP-1012-00623-3: as R1 on sheet SAME51_PINOUT; Number of Pins: 2; Package Reference: 603; Depth: 0.8mm; Mount: SurfaceMount; Package Description: 2-Pin Surface Mount Device, Body 1.6 x 0.85 mm; Datasheet Version: 02/2017; Length: 1.6mm; Lead Free: LeadFree; Height: 0.45mm; Number of Terminations: 2; Max Power Dissipation: 100mW; Min Operating Temperature: -55degC; Datasheet URL: https://industrial.panasonic.com/cdbs/www-data/pdf/RDA0000/AOA0000C304.pdf; Termination: SMD/SMT; Case Code (Metric): 1608; Case Code (Imperial): 0603; Tolerance: 1%; Max Operating Temperature: 155degC; RoHSCompliant: true; Voltage Rating (DC): 75V; Radiation Hardening: No; Packaging: TapeandReel; Composition: ThickFilm; Mounting Technology: SurfaceMount; Manufacturer URL: http://www.panasonic.com/; Width: 0.031inch; REACH SVHC: NoSVHC; Contact Plating: Tin; Military Standard: Not; Package Quantity: 1
TP11 = CMP-00028-00002-2: 0.6mm round; Pins: 1
U6 = CMP-0069-01082-3: SIMPLE SWITCHER® High Efficiency 5A Step-Down Voltage Regulator, 14-pin LLP, Pb-Free; Manufacturer: Texas Instruments; PackageTopMarking: NS*UZXYTT*S0003DB; PowerWise: N; ComponentLink1Description: Datasheet URL; PackageReference: NHM0014A; PackageDescription: LLP, Plastic, Dual, 6 x 5 x 1mm Body, 14 Lead, 0.8mm Pitch, No Pullback; ComponentLink1URL: http://www.ti.com/general/docs/lit/getliterature.tsp?genericPartNumber=LM2678&fileType=pdf; RoHS: Y; PinCount: 14; CompType: Switcher

## Sheet 3V3_REG.SchDoc
size A4; SheetNumber: 4; SheetTotal: 6
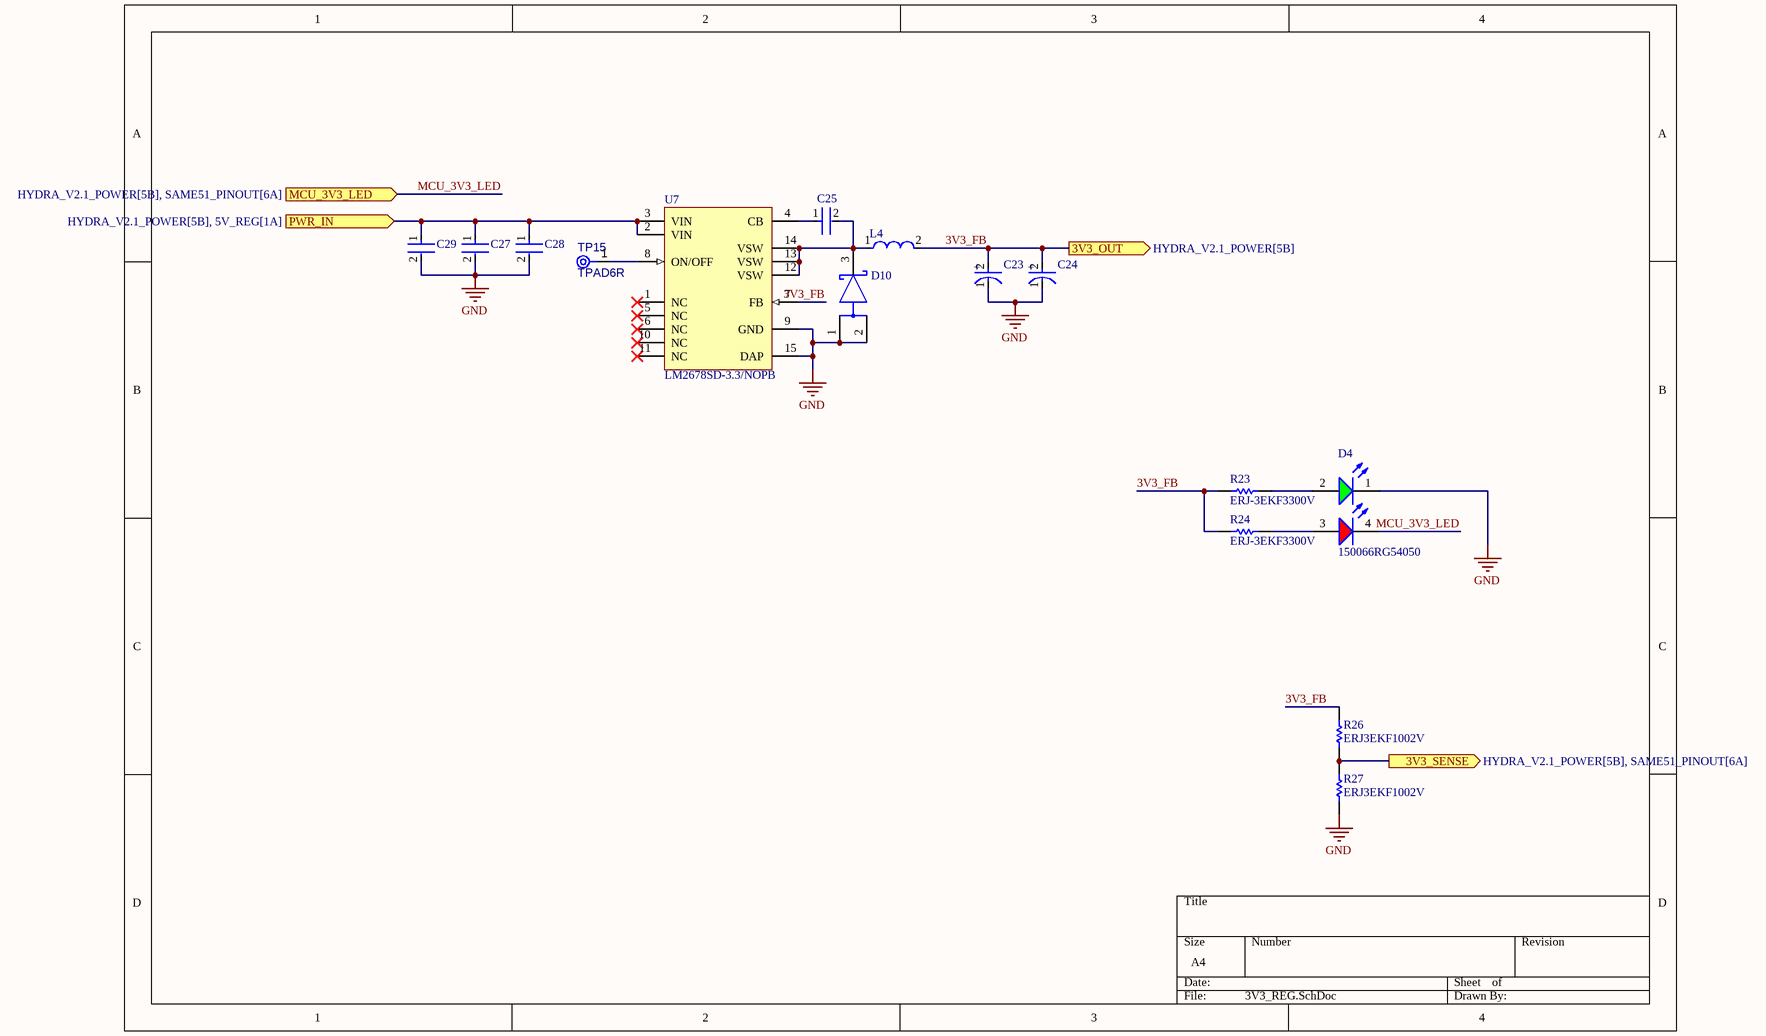
[diagram p3: 3V3_REG.SchDoc]

### Parts
C23  10TPC68M  [FP-POSCAP-D2-MFG]  (value not drawn)
C24  10TPC68M  [FP-POSCAP-D2-MFG]  (value not drawn)
C25  C0805C103J5RACTU  [FP-C0805C-DN-MFG]  (value not drawn)
C27  C2012X5R1V156M125AC  [FP-C2012-125-0_2-MFG]  (value not drawn)
C28  C2012X5R1V156M125AC  [FP-C2012-125-0_2-MFG]  (value not drawn)
C29  C2012X5R1V156M125AC  [FP-C2012-125-0_2-MFG]  (value not drawn)
D4  150066RG54050  [WL-SBCD_0606]
D10  SS5P10-M3/86A  [FP-95570-MFG]  (value not drawn)
L4  IHLP4040DZER220M11  [FP-IHLP-4040DZ-FP_3_124x3-MFG]  (value not drawn)
R23  ERJ-3EKF3300V  [RESC1608X55X30LL15T15]
R24  ERJ-3EKF3300V  [RESC1608X55X30LL15T15]
R26  ERJ3EKF1002V  [RESC1609X55X30LL15T15]
R27  ERJ3EKF1002V  [RESC1609X55X30LL15T15]
TP15  TPAD6R  [TP06R]  (no BOM)
U7  LM2678SD-3.3/NOPB  [NHM0014A_V]

### Ports
3V3_OUT (out, see HYDRA_V2.1_POWER[5B]), 3V3_SENSE (out, see HYDRA_V2.1_POWER[5B], SAME51_PINOUT[6A]), MCU_3V3_LED (in, see HYDRA_V2.1_POWER[5B], SAME51_PINOUT[6A]), PWR_IN (in, see HYDRA_V2.1_POWER[5B], 5V_REG[1A])

### Nets
3V3_FB: C23.2(A) C24.2(A) L4.2 R23.1 R24.1 R26.2 U7.7(FB) ; port 3V3_OUT
GND: C23.1(C) C24.1(C) C27.2 C28.2 C29.2 D4.1(K) D10.1(A) D10.2(A) R27.1 U7.9(GND) U7.15(DAP)
3V3_SENSE: R26.1 R27.2 ; port 3V3_SENSE
MCU_3V3_LED: D4.4(K) ; port MCU_3V3_LED
POST_SHUNT: C27.1 C28.1 C29.1 U7.2(VIN) U7.3(VIN) ; port PWR_IN
NetC25_1: C25.1 U7.4(CB)
NetC25_2: C25.2 D10.3(C) L4.1 U7.12(VSW) U7.13(VSW) U7.14(VSW)
NetD4_2: D4.2(A) R23.2
NetD4_3: D4.3(A) R24.2
NetTP15_1: TP15.1(TP) U7.8(ON/OFF)

Not connected (* = marked no-connect by the designer): U7 1(NC)* 5(NC)* 6(NC)* 10(NC)* 11(NC)*

### Notes on the sheet
- (in symbol CMP-05428-000598-1) +

### Library data of the parts
C23 C24 = CMP-05428-000598-1: as C19 on sheet 5V_REG; Material: Polymer; Voltage Rating: 10V; Voltage: 10V; Features: General Purpose; Width: 4.3mm; Packaging: Tape and Reel; Termination: SMD/SMT; Radiation Hardening: No; Construction: Flat; Height: 1.9mm; Height - Seated (Max): 0.079inch; Case Code (Metric): 7343; Length: 7.3mm; Case/Package: 2917; Depth: 4.3mm; Mount: Surface Mount; Capacitance: 68uF; Case Code (Imperial): 2917; Package Quantity: 3000; Tolerance: 20%; REACH SVHC: No SVHC; Series: POSCAP™ TPC; Lead Free: Lead Free; Min Operating Temperature: -55°C; RoHS Compliant: Yes; Voltage Rating (DC): 10V; Number of Pins: 2; Max Operating Temperature: 105°C
C25 = CMP-2007-00254-2: as C18 on sheet 5V_REG; Device Class L1: Passive Components; Temperature: -55°C to +125°C; Lead Free: Yes; ComponentLink2URL: https://content.kemet.com/datasheets/KEM_C1003_C0G_SMD.pdf; Device Class L3: Ceramic Capacitors; Temperature Characteristic: X7R; Temperature Range High: +125°C; Mouser Description: Capacitor; Ceramic; Cap 0.01uF; Tol 5%; Vol-Rtg 50 V; SMT; Case 0805; X7R; TR; ComponentLink2Description: Datasheet; Manufacturer Part Number: C0805C103J5RACTU; Height: 0.88mm; Digikey Description: CAP CER 10000PF 50V X7R 0805; Capacitance: 10,000 pF; Temperature Range Low: -55°C; Device Class L2: Capacitors; Octopart: https://octopart.com/c0805c103j5ractu-kemet-133473; Voltage Rating: 50 V; Category: Cap; RoHS: TRUE; Automotive: No; Package: C0805C-DN; Ipc Land Pattern Name: CAPC200125X78
C27-C29 = CMP-08246-005496-1: as C20 on sheet 5V_REG; Mount: Surface Mount; Dielectric Material: Ceramic; Package Quantity: 2000; Termination: SMD/SMT; Height: 1.25mm; Min Operating Temperature: -55°C; Tolerance: 20%; Width: 0.049inch; Length: 0.079inch; Lead Free: Lead Free; Max Operating Temperature: 85°C; Voltage Rating: 35V; Case/Package: 0805; Packaging: Tape and Reel; RoHS Compliant: Yes; Case Code (Metric): 2012; Voltage Rating (DC): 35V; Dielectric: X5R; Thickness: 0.057inch; Case Code (Imperial): 0805; Resistor Type: Ceramic; Series: C
D4 = CMP-004-00034-2: as D1 on sheet SAME51_PINOUT
D10 = CMP-02539-000057-1: as D9 on sheet 5V_REG; Case/Package: TO-277A; Number of Pins: 3; Max Reverse Voltage (DC): 100V; Height: 0.031inch; Peak Non-Repetitive Surge Current: 150A; Series: eSMP®; Radiation Hardening: No; Length: 0.242inch; Max Repetitive Reverse Voltage (Vrrm): 100V; Forward Current: 5A; Width: 0.171inch; Min Operating Temperature: -55°C; Max Surge Current: 150A; Lead Free: Lead Free; RoHS Compliant: Yes; Average Rectified Current: 5A; Max Operating Temperature: 150°C; Max Reverse Current: 15uA; Package Quantity: 1500; Packaging: Tape and Reel; Mount: Surface Mount
L4 = CMP-02424-000785-1: as L3 on sheet 5V_REG; Series: IHLP-4040DZ-11; Min Operating Temperature: -55°C; Rated Current-Max: 5A; Current Rating: 5A; Military Standard: Not; Depth: 10.3mm; Height - Seated (Max): 0.157inch; Contact Plating: Tin; Termination: SMD/SMT; Length: 0.43inch; Package Quantity: 1; Width: 0.405inch; Inductance Tolerance: 20%; Tolerance: 20%; Height: 4mm; RMS Current (Irms): 5A; Saturation Current: 4.5A; Inductance: 22uH; Mount: Surface Mount; Max Operating Temperature: 125°C; Case/Package: 4040; Packaging: Tape and Reel; Radiation Hardening: No; RoHS Compliant: Yes; Lead Free: Lead Free
R23 R24 = CMP-2000-00435-2: as R4 on sheet SAME51_PINOUT; REACH SVHC: No SVHC; PackageDescription: 2-Pin Surface Mount Device, Body 1.6 x 0.85 mm; Contact Finish: Gold; Pins: 8; ComponentLink1Description: Manufacturer URL; Packaging: Tape and Reel; Max Operating Temperature: 85 degC; Contact Material: Copper; Height: 1.45 mm; Width: 1.45 mm; DatasheetVersion: Apr-15; Package Quantity: 1500; Contact Plating: Gold; PackageReference: 0603; Mount: Surface Mount; Lead Pitch: 1.1 mm; Min Operating Temperature: -25 degC; ComponentLink1URL: http://www.panasonic.com/; ComponentLink2URL: http://industrial.panasonic.com/cdbs/www-data/pdf/RDA0000/AOA0000C86.pdf; Length: 13.7 mm; ComponentLink2Description: Datasheet; RoHSCompliant: true
R26 R27 = CMP-1012-00623-3: as R1 on sheet SAME51_PINOUT; Number of Pins: 2; Package Reference: 603; Depth: 0.8mm; Mount: SurfaceMount; Package Description: 2-Pin Surface Mount Device, Body 1.6 x 0.85 mm; Datasheet Version: 02/2017; Length: 1.6mm; Lead Free: LeadFree; Height: 0.45mm; Number of Terminations: 2; Max Power Dissipation: 100mW; Min Operating Temperature: -55degC; Datasheet URL: https://industrial.panasonic.com/cdbs/www-data/pdf/RDA0000/AOA0000C304.pdf; Termination: SMD/SMT; Case Code (Metric): 1608; Case Code (Imperial): 0603; Tolerance: 1%; Max Operating Temperature: 155degC; RoHSCompliant: true; Voltage Rating (DC): 75V; Radiation Hardening: No; Packaging: TapeandReel; Composition: ThickFilm; Mounting Technology: SurfaceMount; Manufacturer URL: http://www.panasonic.com/; Width: 0.031inch; REACH SVHC: NoSVHC; Contact Plating: Tin; Military Standard: Not; Package Quantity: 1
TP15 = CMP-00028-00002-2: 0.6mm round; Pins: 1
U7 = CMP-0069-01078-3: SIMPLE SWITCHER® High Efficiency 5A Step-Down Voltage Regulator, 14-pin LLP, Pb-Free; Manufacturer: Texas Instruments; PackageTopMarking: NS*UZXYTT*S0003CB; PowerWise: N; CompType: Switcher; PackageDescription: LLP, Plastic, Dual, 6 x 5 x 1mm Body, 14 Lead, 0.8mm Pitch, No Pullback; PackageReference: NHM0014A; PinCount: 14; ComponentLink1URL: http://www.ti.com/general/docs/lit/getliterature.tsp?genericPartNumber=LM2678&fileType=pdf; RoHS: Y; ComponentLink1Description: Datasheet URL

## Sheet PWR_PROT.SchDoc
size A4; SheetNumber: 5; SheetTotal: 6
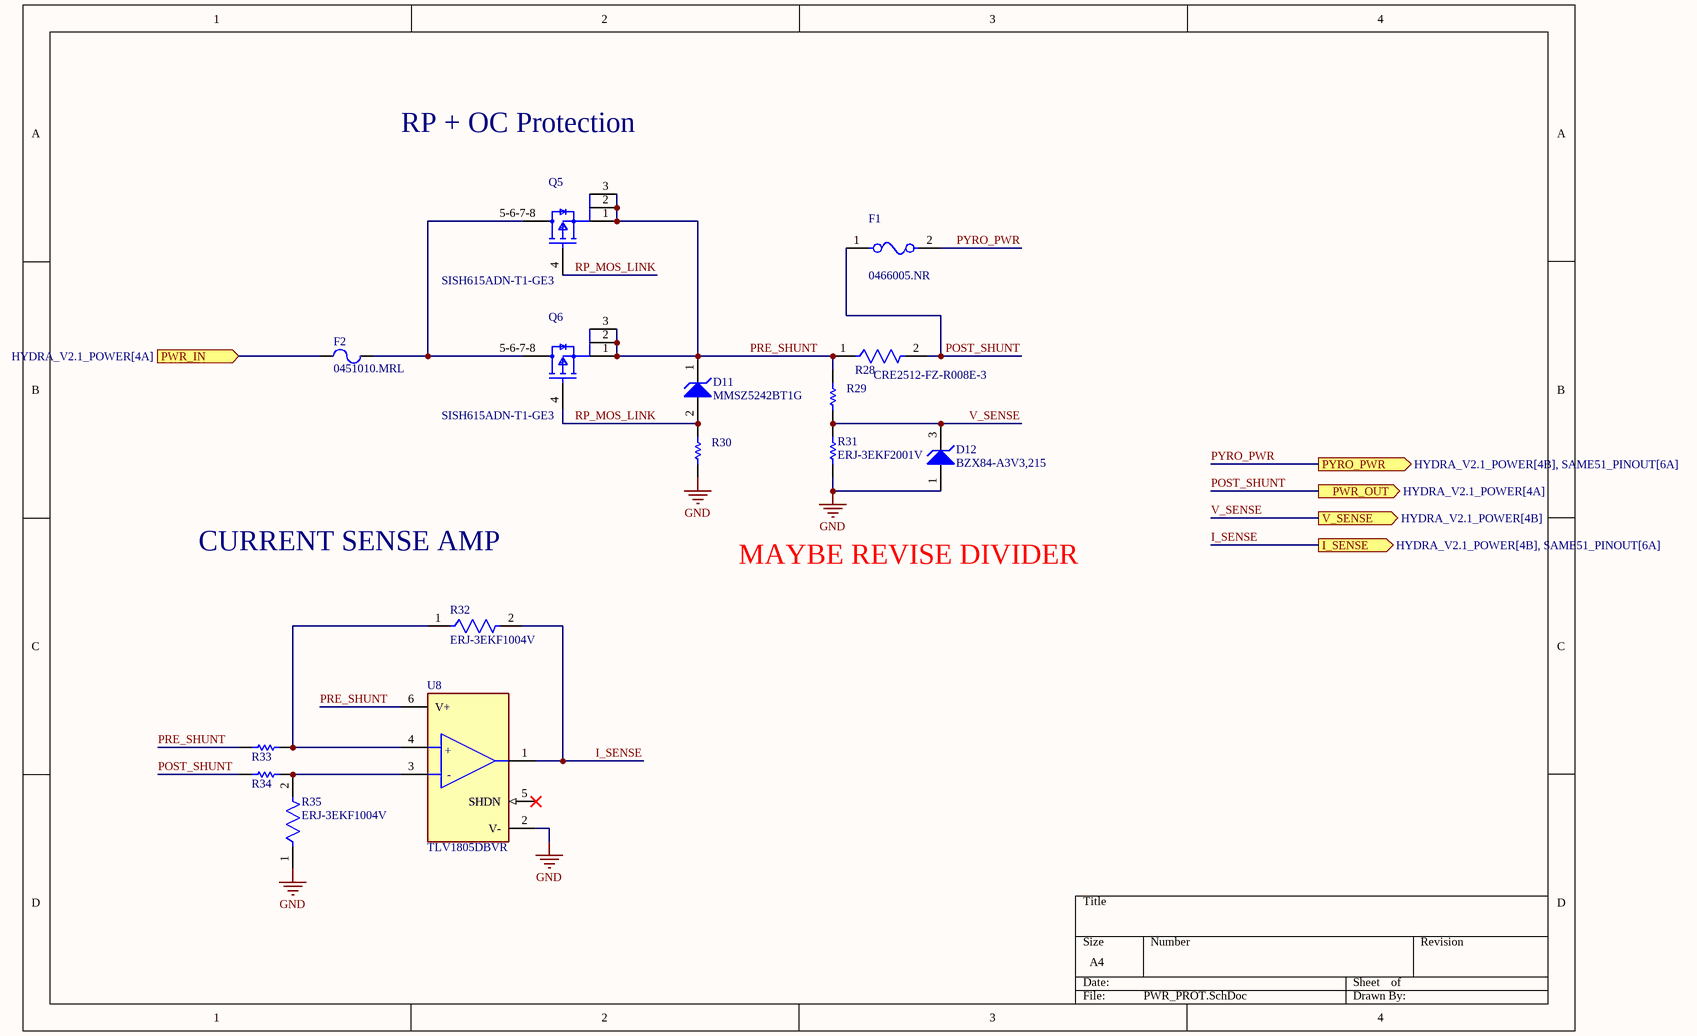
[diagram p4: PWR_PROT.SchDoc]

### Parts
D11  MMSZ5242BT1G  [ONSC-SOD-123-2-425-04_V]
D12  BZX84-A3V3,215  [SOT95P230X110-3N]
F1  0466005.NR  [FP-0466-MFG]
F2  0451010.MRL  [LFUS-45X_V]
Q5  SISH615ADN-T1-GE3  [SISH615ADN-T1-GE3-Footprint-1]
Q6  SISH615ADN-T1-GE3  [SISH615ADN-T1-GE3-Footprint-1]
R28  CRE2512-FZ-R008E-3  [CRF2512-FZ-R005ELF-Footprint-1]
R29  ERJ3EKF1002V  [RESC1609X55X30LL15T15]  (value not drawn)
R30  ERJ3EKF1002V  [RESC1609X55X30LL15T15]  (value not drawn)
R31  ERJ-3EKF2001V  [RESC1608X55X30ML15T15]
R32  ERJ-3EKF1004V  [FP-ERJ3EK-IPC_C]
R33  ERJ3EKF1002V  [RESC1609X55X30LL15T15]  (value not drawn)
R34  ERJ3EKF1002V  [RESC1609X55X30LL15T15]  (value not drawn)
R35  ERJ-3EKF1004V  [FP-ERJ3EK-IPC_C]
U8  TLV1805DBVR  [FP-DBV0006A-IPC_C]

### Ports
I_SENSE (out, see HYDRA_V2.1_POWER[4B], SAME51_PINOUT[6A]), PWR_IN (in, see HYDRA_V2.1_POWER[4A]), PWR_OUT (out, see HYDRA_V2.1_POWER[4A]), PYRO_PWR (out, see HYDRA_V2.1_POWER[4B], SAME51_PINOUT[6A]), V_SENSE (out, see HYDRA_V2.1_POWER[4B])

### Nets
GND: D12.1(A) R30.2 R31.1 R35.1 U8.2(V-)
I_SENSE: R32.2 U8.1(OUT) ; port I_SENSE
POST_SHUNT: F1.1 R28.2 R34.1 ; port PWR_OUT
PRE_SHUNT: D11.1(K) Q5.1(S) Q5.2(S) Q5.3(S) Q6.1(S) Q6.2(S) Q6.3(S) R28.1 R29.1 R33.1 U8.6(V+)
PYRO_PWR: F1.2 ; port PYRO_PWR
RP_MOS_LINK: D11.2(A) Q5.4(G) Q6.4(G) R30.1
V_SENSE: D12.3(K) R29.2 R31.2 ; port V_SENSE
NetF2_1: F2.1 ; port PWR_IN
NetF2_2: F2.2 Q5.5-6-7-8(D) Q6.5-6-7-8(D)
NetR32_1: R32.1 R33.2 U8.4(+IN)
NetR34_2: R34.2 R35.2 U8.3(-IN)

Not connected (* = marked no-connect by the designer): U8 5(SHDN)*

### Notes on the sheet
- RP + OC Protection
- CURRENT SENSE AMP
- MAYBE REVISE DIVIDER
- (in symbol CMP-04896-000098-1) +; -

### Library data of the parts
D11 = CMP-1060-00565-1: Zener Voltage Regulator, 500 mW, 2-Pin SOD-123, Pb-Free, Tape and Reel; Manufacturer: On Semiconductor; P Max (W): 0.5; VZ Typ (V): 12; PartNumber: MMSZ5242BT1G; PackageReference: SOD-123-2-425-04; ComponentLink3URL: http://www.onsemi.com/pub_link/Collateral/425-04.PDF; Mounting Technology: Surface Mount; ComponentLink2Description: Datasheet; ComponentLink1URL: http://www.onsemi.com/; ComponentLink3Description: Package Specification; PackageDescription: 2-Pin SOD, Body 1.6 x 2.69 mm; PackageVersion: Rev. G, 10/2009; ComponentLink1Description: Manufacturer URL; RoHS: Pb-Free; ComponentLink2URL: http://www.onsemi.com/pub_link/Collateral/MMSZ5221BT1-D.PDF; Packing: Tape and Reel; DatasheetVersion: Rev. 12
D12 = CMP-004-00035-1: DIODE ZENER 3.3V 250MW SOT23
F1 = CMP-08605-000032-1: FUSE BOARD MNT 5A 32VAC/VDC 1206; Manufacturer: Littelfuse Inc; Value: 0.011Ω; Max Fuse Ac Voltage: 32V; Fuse I2T: 2.5A2Sec; Fuse Interrupt Ac Current: 50A; Fuse Blow Speed: Fast; Fuse Voltage Drop: 73.75mV; Category: Fuse; Temperature: -55°C to +90°C; Lead Free: Yes; Temperature Range High: +90°C; RoHS: TRUE; Device Class L2: Fuses; ComponentLink2URL: https://www.littelfuse.com/~/media/electronics/datasheets/fuses/littelfuse_fuse_466_datasheet.pdf.pdf; Fuse Current: 5A; Octopart: https://octopart.com/0466005.nr-littelfuse-143206; Automotive: No; Max Fuse Dc Voltage: 32V; Temperature Range Low: -55°C; Device Class L3: unset; ComponentLink2Description: Datasheet; Manufacturer Part Number: 0466005.NR; Fuse Interrupt Dc Current: 50A; Resistance: 0.011Ω; Package: 0466; Device Class L1: Circuit Protection; Mouser Description: Surface Mount Fuses 32V 5A VFA Slimline; Height: 0.66mm; Voltage Rating: 32V; Digikey Description: FUSE BOARD MNT 5A 32VAC/VDC 1206
F2 = CMP-2000-05664-1: Fuse, 125 V, 10 A, -55 to 125 degC, 2-Pin SMD, RoHS, Tape and Reel; Manufacturer: Littelfuse; Working Voltage-Max: 125V; Response Characteristic: VeryFastActing; Current Rating: 10A; Manufacturer URL: http://www.littelfuse.com/; Mounting Technology: SurfaceMount; Size: 6.10x2.69mm; Operating Temp Range: -55to+125°C; Package Description: 2-Pin Surface Mount Device, Body 6.1 x 2.69 mm; Package Reference: 45X; Datasheet Version: 02/2016; Datasheet URL: http://www.littelfuse.com/products/fuses/surface-mount-fuses/nano-2-fuses/~/media/electronics/datasheets/fuses/littelfuse_fuse_451_453_datasheet.pdf.pdf
Q5 Q6 = CMP-013-00036-2: Trans MOSFET P-CH 20V 22.1A 8-Pin PowerPAK 1212 EP T/R
R28 = CMP-009-00183-1: Actually https://www.digikey.ca/en/products/detail/bourns-inc/CRE2512-FZ-R008E-3/4900057
R29 R30 R33 R34 = CMP-1012-00623-3: as R1 on sheet SAME51_PINOUT; Number of Pins: 2; Package Reference: 603; Depth: 0.8mm; Mount: SurfaceMount; Package Description: 2-Pin Surface Mount Device, Body 1.6 x 0.85 mm; Datasheet Version: 02/2017; Length: 1.6mm; Lead Free: LeadFree; Height: 0.45mm; Number of Terminations: 2; Max Power Dissipation: 100mW; Min Operating Temperature: -55degC; Datasheet URL: https://industrial.panasonic.com/cdbs/www-data/pdf/RDA0000/AOA0000C304.pdf; Termination: SMD/SMT; Case Code (Metric): 1608; Case Code (Imperial): 0603; Tolerance: 1%; Max Operating Temperature: 155degC; RoHSCompliant: true; Voltage Rating (DC): 75V; Radiation Hardening: No; Packaging: TapeandReel; Composition: ThickFilm; Mounting Technology: SurfaceMount; Manufacturer URL: http://www.panasonic.com/; Width: 0.031inch; REACH SVHC: NoSVHC; Contact Plating: Tin; Military Standard: Not; Package Quantity: 1
R31 = CMP-2000-00317-1: Manufacturer: Panasonic; Part Number: ERJ-3EKF2001V
R32 R35 = CMP-1012-00849-3: RES SMD 1M OHM 1% 1/10W 0603; Resistance: 1MR; Voltage Rating: 75V; Temperature Coefficient: 100ppm/°C; Power Rating: 100mW; REACH SVHC: No SVHC; Radiation Hardening: No; Features: Automotive AEC-Q200; Case Code (Metric): 1608; Resistance Tolerance: 1%; Case/Package: 0603; Termination: SMD/SMT; Max Operating Temperature: 155°C; Tolerance: 1%; Size Code: 0603; Case Code (Imperial): 0603; Min Operating Temperature: -55°C; Number of Pins: 2; Mount: Surface Mount; Package Quantity: 1; Military Standard: Not; Voltage Rating (DC): 75V; Depth: 0.8mm; Packaging: Tape and Reel; Width: 0.8mm; Number of Terminations: 2; Length: 1.6mm; Height: 0.022inch; RoHS Compliant: Yes; Resistor Type: Thick Film; Contact Plating: Tin; Lead Free: Lead Free; Series: ERJ; Construction: Rectangular; Max Power Dissipation: 100mW
U8 = CMP-04896-000098-1: 40V, RAIL-TO-RAIL INPUT, PUSH-PU

## Nets that join several sheets
3V3_FB: HYDRA_V2.1_POWER (8 pins), SAME51_PINOUT (21 pins), 3V3_REG (7 pins)
5V_FB: HYDRA_V2.1_POWER (8 pins), SAME51_PINOUT (D1.2 TP1.1), 5V_REG (7 pins)
GND: HYDRA_V2.1_POWER (37 pins), SAME51_PINOUT (36 pins), 5V_REG (11 pins), 3V3_REG (11 pins), PWR_PROT (5 pins)
VCC: HYDRA_V2.1_POWER (J1.01 J1.02 J3.01 J3.02), SAME51_PINOUT (TP2.1)
3V3_SENSE: SAME51_PINOUT (U1.62), 3V3_REG (R26.1 R27.2)
5V_ON_nOFF: SAME51_PINOUT (R36.1), 5V_REG (TP11.1 U6.8)
5V_SENSE: SAME51_PINOUT (U1.63), 5V_REG (R20.1 R22.2)
CAN0_R_N: HYDRA_V2.1_POWER (J1.16 J3.16), SAME51_PINOUT (R2.1 TP7.1 U2.6)
CAN0_R_P: HYDRA_V2.1_POWER (J1.15 J3.15), SAME51_PINOUT (R2.2 TP5.1 U2.7)
CAN1_R_N: HYDRA_V2.1_POWER (J1.20 J3.20), SAME51_PINOUT (R7.1 TP8.1 U5.6)
CAN1_R_P: HYDRA_V2.1_POWER (J1.19 J3.19), SAME51_PINOUT (R7.2 TP6.1 U5.7)
I_SENSE: SAME51_PINOUT (U1.20), PWR_PROT (R32.2 U8.1)
MCU_3V3_LED: SAME51_PINOUT (U1.11), 3V3_REG (D4.4)
MCU_5V_LED: SAME51_PINOUT (U1.10), 5V_REG (D3.4)
NetF2_1: HYDRA_V2.1_POWER (PAD1.1), PWR_PROT (F2.1)
POST_SHUNT: 5V_REG (5 pins), 3V3_REG (5 pins), PWR_PROT (F1.1 R28.2 R34.1)
PYRO_PWR: HYDRA_V2.1_POWER (16 pins), SAME51_PINOUT (R21.2 TP12.1), PWR_PROT (F1.2)
V_SENSE: SAME51_PINOUT (U1.61), PWR_PROT (D12.3 R29.2 R31.2)